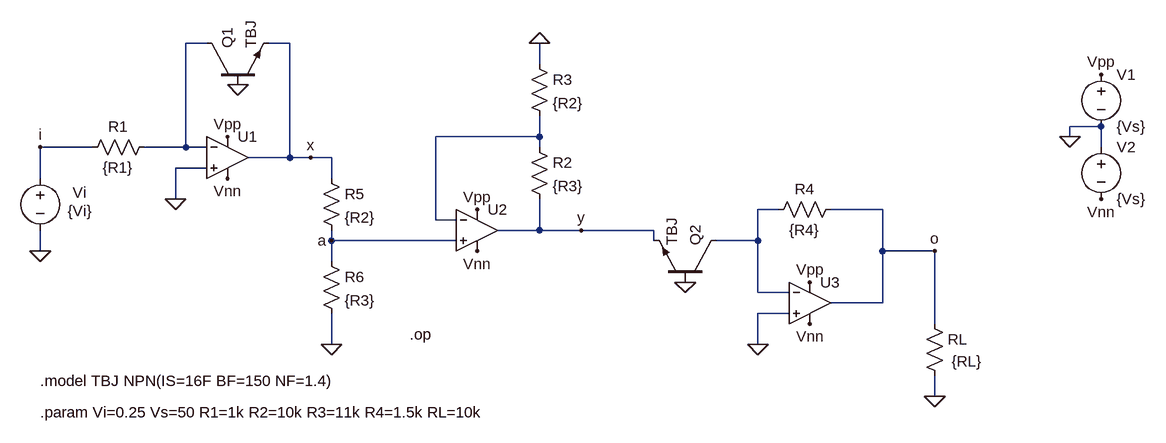
[diagram p0: schematic OPAMPTBJ05.asc]
OPAMPTBJ05.asc, the LTspice schematic file:
Version 4
SHEET 1 1608 1076
WIRE -128 192 -160 192
WIRE 0 192 -32 192
WIRE 384 224 384 192
WIRE 1248 320 1200 320
WIRE 384 336 384 304
WIRE 384 336 224 336
WIRE 1200 336 1200 320
WIRE -304 352 -384 352
WIRE -160 352 -160 192
WIRE -160 352 -224 352
WIRE -128 352 -160 352
WIRE 384 352 384 336
WIRE 1248 352 1248 320
WIRE 0 368 0 192
WIRE 0 368 -64 368
WIRE 32 368 0 368
WIRE 64 368 32 368
WIRE -128 384 -176 384
WIRE -384 400 -384 352
WIRE 64 400 64 368
WIRE -176 432 -176 384
WIRE 752 448 720 448
WIRE 912 448 832 448
WIRE 224 464 224 336
WIRE 256 464 224 464
WIRE 384 480 384 432
WIRE 384 480 320 480
WIRE 448 480 384 480
WIRE 560 480 448 480
WIRE 64 496 64 480
WIRE 256 496 64 496
WIRE 560 496 560 480
WIRE 720 496 720 448
WIRE 720 496 656 496
WIRE -384 512 -384 480
WIRE 912 512 912 448
WIRE 992 512 912 512
WIRE 64 528 64 496
WIRE 720 576 720 496
WIRE 768 576 720 576
WIRE 912 592 912 512
WIRE 912 592 832 592
WIRE 768 608 720 608
WIRE 992 624 992 512
WIRE 64 656 64 608
WIRE 720 656 720 608
WIRE 992 736 992 704
FLAG 1248 240 Vpp
FLAG 1200 336 0
FLAG 1248 432 Vnn
FLAG 992 736 0
FLAG -384 512 0
FLAG -96 336 Vpp
FLAG -96 400 Vnn
FLAG -176 432 0
FLAG -80 256 0
FLAG 800 560 Vpp
FLAG 800 624 Vnn
FLAG 720 656 0
FLAG 608 560 0
FLAG 992 512 o
FLAG 32 368 x
FLAG 288 448 Vpp
FLAG 288 512 Vnn
FLAG 384 192 0
FLAG 448 480 y
FLAG 64 656 0
FLAG 64 496 a
FLAG -384 352 i
SYMBOL npn -128 256 R270
SYMATTR InstName Q1
SYMATTR Value TBJ
SYMBOL voltage 1248 224 R0
WINDOW 123 0 0 Left 0
WINDOW 39 0 0 Left 0
SYMATTR InstName V1
SYMATTR Value {Vs}
SYMBOL voltage 1248 336 R0
WINDOW 123 0 0 Left 0
WINDOW 39 0 0 Left 0
SYMATTR InstName V2
SYMATTR Value {Vs}
SYMBOL res 976 608 R0
WINDOW 3 42 74 Left 2
SYMATTR Value {RL}
SYMATTR InstName RL
SYMBOL voltage -384 384 R0
WINDOW 3 42 66 Left 2
WINDOW 123 0 0 Left 0
WINDOW 39 0 0 Left 0
WINDOW 0 50 38 Left 2
SYMATTR Value {Vi}
SYMATTR InstName Vi
SYMBOL Opamps\\UniversalOpamp2 -96 368 R0
SYMATTR InstName U1
SYMBOL res -320 368 R270
WINDOW 0 32 56 VTop 2
WINDOW 3 0 56 VBottom 2
SYMATTR InstName R1
SYMATTR Value {R1}
SYMBOL npn 656 560 M270
SYMATTR InstName Q2
SYMATTR Value TBJ
SYMBOL Opamps\\UniversalOpamp2 800 592 R0
SYMATTR InstName U3
SYMBOL res 736 464 R270
WINDOW 0 32 56 VTop 2
WINDOW 3 0 56 VBottom 2
SYMATTR InstName R4
SYMATTR Value {R4}
SYMBOL Opamps\\UniversalOpamp2 288 480 R0
SYMATTR InstName U2
SYMBOL res 368 336 R0
SYMATTR InstName R2
SYMATTR Value {R3}
SYMBOL res 368 208 R0
SYMATTR InstName R3
SYMATTR Value {R2}
SYMBOL res 48 384 R0
SYMATTR InstName R5
SYMATTR Value {R2}
SYMBOL res 48 512 R0
SYMATTR InstName R6
SYMATTR Value {R3}
TEXT -384 760 Left 2 !.param Vi=0.25 Vs=50 R1=1k R2=10k R3=11k R4=1.5k RL=10k
TEXT 184 640 Left 2 !.op
TEXT -384 712 Left 2 !.model TBJ NPN(IS=16F BF=150 NF=1.4)

The netlist it stands for:
* OPAMPTBJ05.asc
Q1 N001 0 x 0 TBJ
V1 Vpp 0 {Vs}
V2 0 Vnn {Vs}
RL o 0 {RL}
Vi i 0 {Vi}
XU1 0 N001 Vpp Vnn x level.2 Avol=1Meg GBW=10Meg Slew=10Meg ilimit=25m rail=0 Vos=0 phimargin=45 en=0 enk=0 in=0 ink=0 Rin=500Meg  ; pins IN+ IN- V+ V- OUT
R1 i N001 {R1}
Q2 N003 0 y 0 TBJ
XU3 0 N003 Vpp Vnn o level.2 Avol=1Meg GBW=10Meg Slew=10Meg ilimit=25m rail=0 Vos=0 phimargin=45 en=0 enk=0 in=0 ink=0 Rin=500Meg  ; pins IN+ IN- V+ V- OUT
R4 N003 o {R4}
XU2 a N002 Vpp Vnn y level.2 Avol=1Meg GBW=10Meg Slew=10Meg ilimit=25m rail=0 Vos=0 phimargin=45 en=0 enk=0 in=0 ink=0 Rin=500Meg  ; pins IN+ IN- V+ V- OUT
R2 N002 y {R3}
R3 0 N002 {R2}
R5 x a {R2}
R6 a 0 {R3}
.model NPN NPN
.model PNP PNP
.lib standard.bjt
.param Vi=0.25 Vs=50 R1=1k R2=10k R3=11k R4=1.5k RL=10k
.op
.model TBJ NPN(IS=16F BF=150 NF=1.4)
.lib UniversalOpamps2.sub
.backanno
.end